# EAGLE design 8iPanelDec (EAGLE 6.6.0)
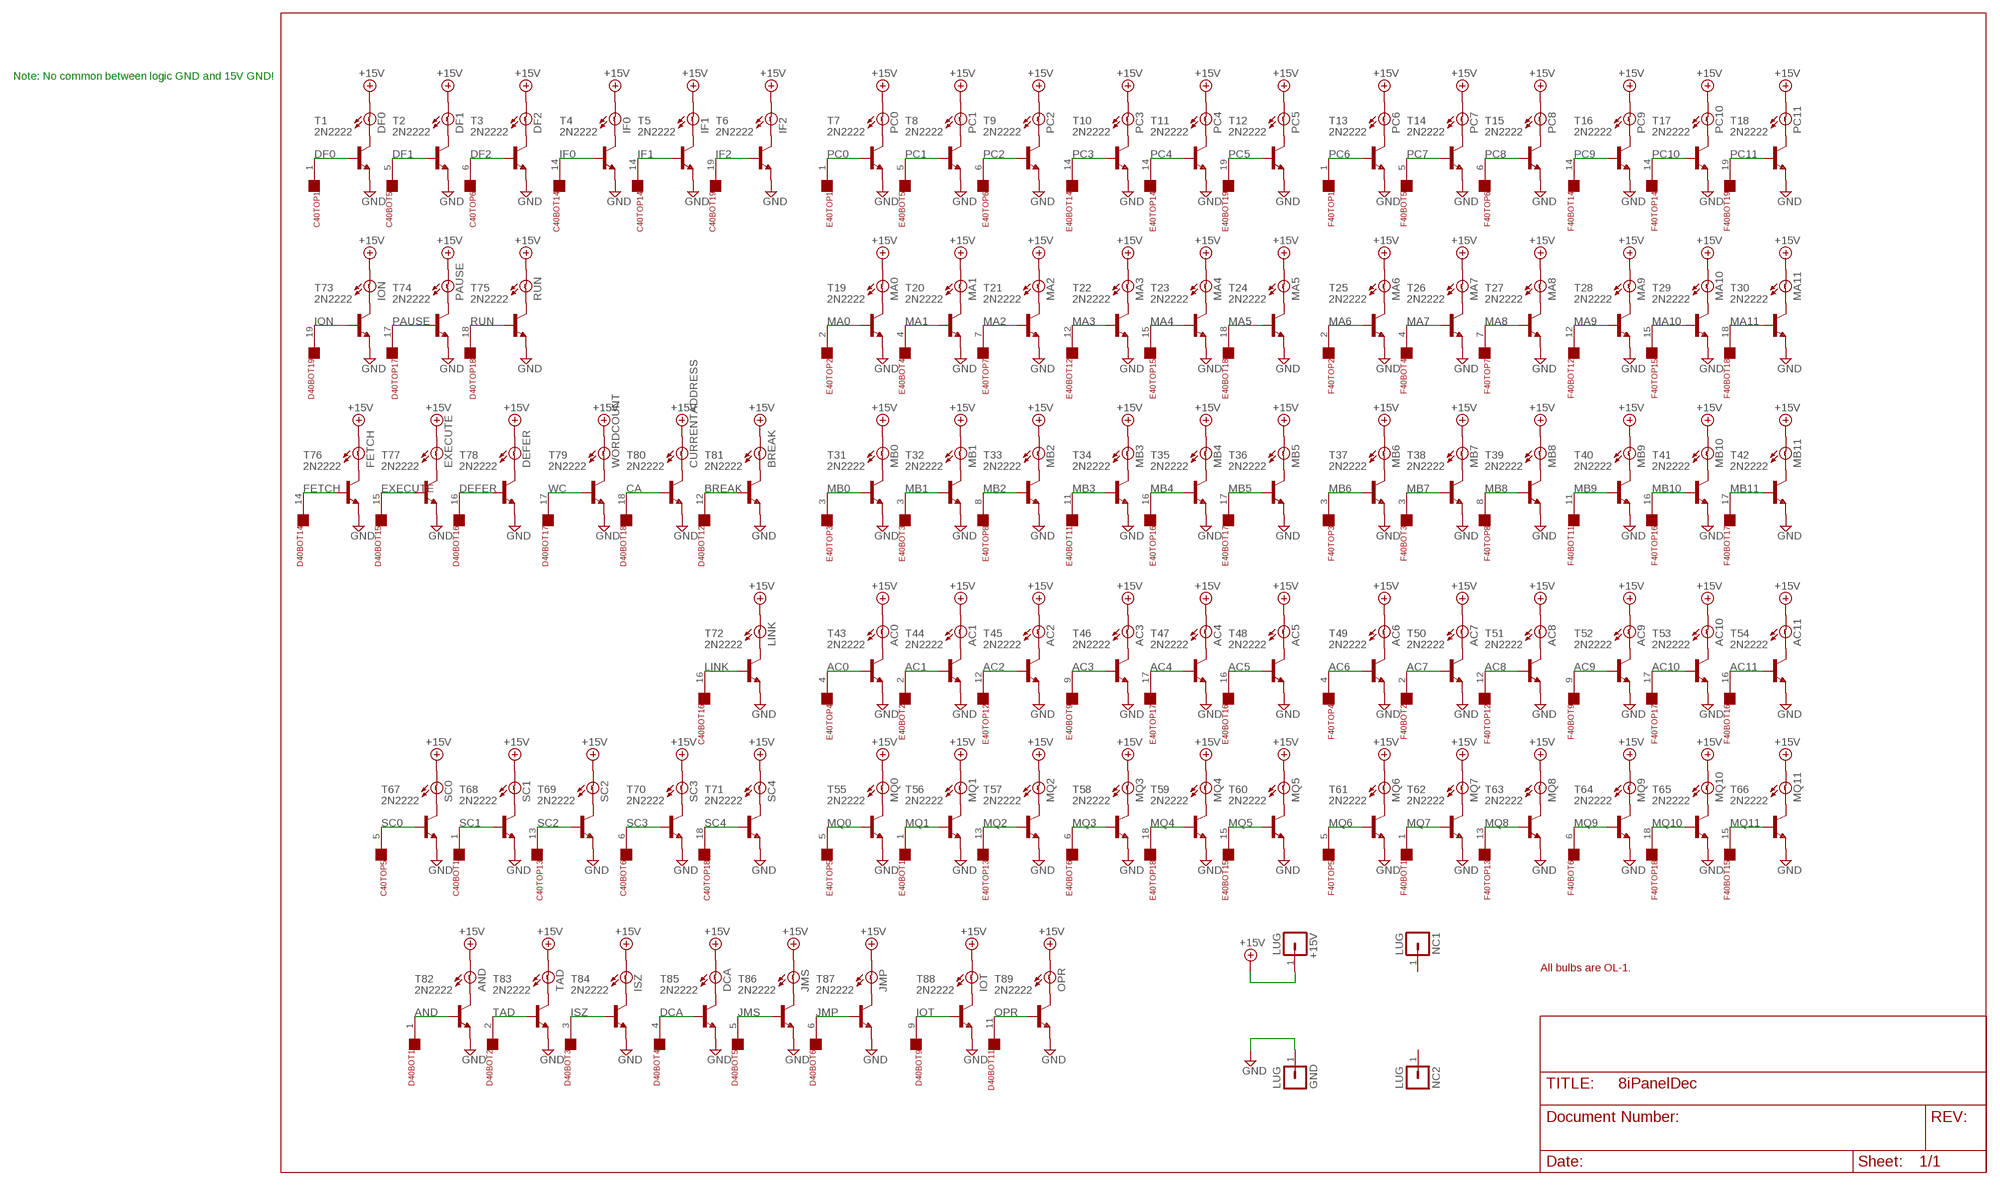
[diagram p0: schematic, sheet 1]

## Parts
+15V  LUG  [SPADELUG]
AC0  BULB  [BULB]
AC1  BULB  [BULB]
AC2  BULB  [BULB]
AC3  BULB  [BULB]
AC4  BULB  [BULB]
AC5  BULB  [BULB]
AC6  BULB  [BULB]
AC7  BULB  [BULB]
AC8  BULB  [BULB]
AC9  BULB  [BULB]
AC10  BULB  [BULB]
AC11  BULB  [BULB]
AND  BULB  [BULB]
BREAK  BULB  [BULB]
C40BOT  FLEX19  [FLEX19]
C40TOP  FLEX19  [FLEX19]
CURRENTADDRESS  BULB  [BULB]
D40BOT  FLEX19  [FLEX19]
D40TOP  FLEX19  [FLEX19]
DCA  BULB  [BULB]
DEFER  BULB  [BULB]
DF0  BULB  [BULB]
DF1  BULB  [BULB]
DF2  BULB  [BULB]
E40BOT  FLEX19  [FLEX19]
E40TOP  FLEX19  [FLEX19]
EXECUTE  BULB  [BULB]
F40BOT  FLEX19  [FLEX19]
F40TOP  FLEX19  [FLEX19]
FETCH  BULB  [BULB]
GND  LUG  [SPADELUG]
IF0  BULB  [BULB]
IF1  BULB  [BULB]
IF2  BULB  [BULB]
ION  BULB  [BULB]
IOT  BULB  [BULB]
ISZ  BULB  [BULB]
JMP  BULB  [BULB]
JMS  BULB  [BULB]
LINK  BULB  [BULB]
MA0  BULB  [BULB]
MA1  BULB  [BULB]
MA2  BULB  [BULB]
MA3  BULB  [BULB]
MA4  BULB  [BULB]
MA5  BULB  [BULB]
MA6  BULB  [BULB]
MA7  BULB  [BULB]
MA8  BULB  [BULB]
MA9  BULB  [BULB]
MA10  BULB  [BULB]
MA11  BULB  [BULB]
MB0  BULB  [BULB]
MB1  BULB  [BULB]
MB2  BULB  [BULB]
MB3  BULB  [BULB]
MB4  BULB  [BULB]
MB5  BULB  [BULB]
MB6  BULB  [BULB]
MB7  BULB  [BULB]
MB8  BULB  [BULB]
MB9  BULB  [BULB]
MB10  BULB  [BULB]
MB11  BULB  [BULB]
MQ0  BULB  [BULB]
MQ1  BULB  [BULB]
MQ2  BULB  [BULB]
MQ3  BULB  [BULB]
MQ4  BULB  [BULB]
MQ5  BULB  [BULB]
MQ6  BULB  [BULB]
MQ7  BULB  [BULB]
MQ8  BULB  [BULB]
MQ9  BULB  [BULB]
MQ10  BULB  [BULB]
MQ11  BULB  [BULB]
NC1  LUG  [SPADELUG]
NC2  LUG  [SPADELUG]
OPR  BULB  [BULB]
PAUSE  BULB  [BULB]
PC0  BULB  [BULB]
PC1  BULB  [BULB]
PC2  BULB  [BULB]
PC3  BULB  [BULB]
PC4  BULB  [BULB]
PC5  BULB  [BULB]
PC6  BULB  [BULB]
PC7  BULB  [BULB]
PC8  BULB  [BULB]
PC9  BULB  [BULB]
PC10  BULB  [BULB]
PC11  BULB  [BULB]
RUN  BULB  [BULB]
SC0  BULB  [BULB]
SC1  BULB  [BULB]
SC2  BULB  [BULB]
SC3  BULB  [BULB]
SC4  BULB  [BULB]
T1  2N2222  -NPN-TO92  [TO92]
T2  2N2222  -NPN-TO92  [TO92]
T3  2N2222  -NPN-TO92  [TO92]
T4  2N2222  -NPN-TO92  [TO92]
T5  2N2222  -NPN-TO92  [TO92]
T6  2N2222  -NPN-TO92  [TO92]
T7  2N2222  -NPN-TO92  [TO92]
T8  2N2222  -NPN-TO92  [TO92]
T9  2N2222  -NPN-TO92  [TO92]
T10  2N2222  -NPN-TO92  [TO92]
T11  2N2222  -NPN-TO92  [TO92]
T12  2N2222  -NPN-TO92  [TO92]
T13  2N2222  -NPN-TO92  [TO92]
T14  2N2222  -NPN-TO92  [TO92]
T15  2N2222  -NPN-TO92  [TO92]
T16  2N2222  -NPN-TO92  [TO92]
T17  2N2222  -NPN-TO92  [TO92]
T18  2N2222  -NPN-TO92  [TO92]
T19  2N2222  -NPN-TO92  [TO92]
T20  2N2222  -NPN-TO92  [TO92]
T21  2N2222  -NPN-TO92  [TO92]
T22  2N2222  -NPN-TO92  [TO92]
T23  2N2222  -NPN-TO92  [TO92]
T24  2N2222  -NPN-TO92  [TO92]
T25  2N2222  -NPN-TO92  [TO92]
T26  2N2222  -NPN-TO92  [TO92]
T27  2N2222  -NPN-TO92  [TO92]
T28  2N2222  -NPN-TO92  [TO92]
T29  2N2222  -NPN-TO92  [TO92]
T30  2N2222  -NPN-TO92  [TO92]
T31  2N2222  -NPN-TO92  [TO92]
T32  2N2222  -NPN-TO92  [TO92]
T33  2N2222  -NPN-TO92  [TO92]
T34  2N2222  -NPN-TO92  [TO92]
T35  2N2222  -NPN-TO92  [TO92]
T36  2N2222  -NPN-TO92  [TO92]
T37  2N2222  -NPN-TO92  [TO92]
T38  2N2222  -NPN-TO92  [TO92]
T39  2N2222  -NPN-TO92  [TO92]
T40  2N2222  -NPN-TO92  [TO92]
T41  2N2222  -NPN-TO92  [TO92]
T42  2N2222  -NPN-TO92  [TO92]
T43  2N2222  -NPN-TO92  [TO92]
T44  2N2222  -NPN-TO92  [TO92]
T45  2N2222  -NPN-TO92  [TO92]
T46  2N2222  -NPN-TO92  [TO92]
T47  2N2222  -NPN-TO92  [TO92]
T48  2N2222  -NPN-TO92  [TO92]
T49  2N2222  -NPN-TO92  [TO92]
T50  2N2222  -NPN-TO92  [TO92]
T51  2N2222  -NPN-TO92  [TO92]
T52  2N2222  -NPN-TO92  [TO92]
T53  2N2222  -NPN-TO92  [TO92]
T54  2N2222  -NPN-TO92  [TO92]
T55  2N2222  -NPN-TO92  [TO92]
T56  2N2222  -NPN-TO92  [TO92]
T57  2N2222  -NPN-TO92  [TO92]
T58  2N2222  -NPN-TO92  [TO92]
T59  2N2222  -NPN-TO92  [TO92]
T60  2N2222  -NPN-TO92  [TO92]
T61  2N2222  -NPN-TO92  [TO92]
T62  2N2222  -NPN-TO92  [TO92]
T63  2N2222  -NPN-TO92  [TO92]
T64  2N2222  -NPN-TO92  [TO92]
T65  2N2222  -NPN-TO92  [TO92]
T66  2N2222  -NPN-TO92  [TO92]
T67  2N2222  -NPN-TO92  [TO92]
T68  2N2222  -NPN-TO92  [TO92]
T69  2N2222  -NPN-TO92  [TO92]
T70  2N2222  -NPN-TO92  [TO92]
T71  2N2222  -NPN-TO92  [TO92]
T72  2N2222  -NPN-TO92  [TO92]
T73  2N2222  -NPN-TO92  [TO92]
T74  2N2222  -NPN-TO92  [TO92]
T75  2N2222  -NPN-TO92  [TO92]
T76  2N2222  -NPN-TO92  [TO92]
T77  2N2222  -NPN-TO92  [TO92]
T78  2N2222  -NPN-TO92  [TO92]
T79  2N2222  -NPN-TO92  [TO92]
T80  2N2222  -NPN-TO92  [TO92]
T81  2N2222  -NPN-TO92  [TO92]
T82  2N2222  -NPN-TO92  [TO92]
T83  2N2222  -NPN-TO92  [TO92]
T84  2N2222  -NPN-TO92  [TO92]
T85  2N2222  -NPN-TO92  [TO92]
T86  2N2222  -NPN-TO92  [TO92]
T87  2N2222  -NPN-TO92  [TO92]
T88  2N2222  -NPN-TO92  [TO92]
T89  2N2222  -NPN-TO92  [TO92]
TAD  BULB  [BULB]
WORDCOUNT  BULB  [BULB]

## Nets
+15V [supply]: +15V.1 AC0.A AC1.A AC2.A AC3.A AC4.A AC5.A AC6.A AC7.A AC8.A AC9.A AC10.A AC11.A AND.A BREAK.A CURRENTADDRESS.A DCA.A DEFER.A DF0.A DF1.A DF2.A EXECUTE.A FETCH.A IF0.A IF1.A IF2.A ION.A IOT.A ISZ.A JMP.A JMS.A LINK.A MA0.A MA1.A MA2.A MA3.A MA4.A MA5.A MA6.A MA7.A MA8.A MA9.A MA10.A MA11.A MB0.A MB1.A MB2.A MB3.A MB4.A MB5.A MB6.A MB7.A MB8.A MB9.A MB10.A MB11.A MQ0.A MQ1.A MQ2.A MQ3.A MQ4.A MQ5.A MQ6.A MQ7.A MQ8.A MQ9.A MQ10.A MQ11.A OPR.A PAUSE.A PC0.A PC1.A PC2.A PC3.A PC4.A PC5.A PC6.A PC7.A PC8.A PC9.A PC10.A PC11.A RUN.A SC0.A SC1.A SC2.A SC3.A SC4.A TAD.A WORDCOUNT.A
AC0: E40TOP.4 T43.2(B)
AC1: E40BOT.2 T44.2(B)
AC2: E40TOP.12 T45.2(B)
AC3: E40BOT.9 T46.2(B)
AC4: E40TOP.17 T47.2(B)
AC5: E40BOT.16 T48.2(B)
AC6: F40TOP.4 T49.2(B)
AC7: F40BOT.2 T50.2(B)
AC8: F40TOP.12 T51.2(B)
AC9: F40BOT.9 T52.2(B)
AC10: F40TOP.17 T53.2(B)
AC11: F40BOT.16 T54.2(B)
AND: D40BOT.1 T82.2(B)
BREAK: D40BOT.12 T81.2(B)
CA: D40BOT.18 T80.2(B)
DCA: D40BOT.4 T85.2(B)
DEFER: D40BOT.16 T78.2(B)
DF0: C40TOP.1 T1.2(B)
DF1: C40BOT.5 T2.2(B)
DF2: C40TOP.6 T3.2(B)
EXECUTE: D40BOT.15 T77.2(B)
FETCH: D40BOT.14 T76.2(B)
GND [supply]: GND.1 T1.1(E) T2.1(E) T3.1(E) T4.1(E) T5.1(E) T6.1(E) T7.1(E) T8.1(E) T9.1(E) T10.1(E) T11.1(E) T12.1(E) T13.1(E) T14.1(E) T15.1(E) T16.1(E) T17.1(E) T18.1(E) T19.1(E) T20.1(E) T21.1(E) T22.1(E) T23.1(E) T24.1(E) T25.1(E) T26.1(E) T27.1(E) T28.1(E) T29.1(E) T30.1(E) T31.1(E) T32.1(E) T33.1(E) T34.1(E) T35.1(E) T36.1(E) T37.1(E) T38.1(E) T39.1(E) T40.1(E) T41.1(E) T42.1(E) T43.1(E) T44.1(E) T45.1(E) T46.1(E) T47.1(E) T48.1(E) T49.1(E) T50.1(E) T51.1(E) T52.1(E) T53.1(E) T54.1(E) T55.1(E) T56.1(E) T57.1(E) T58.1(E) T59.1(E) T60.1(E) T61.1(E) T62.1(E) T63.1(E) T64.1(E) T65.1(E) T66.1(E) T67.1(E) T68.1(E) T69.1(E) T70.1(E) T71.1(E) T72.1(E) T73.1(E) T74.1(E) T75.1(E) T76.1(E) T77.1(E) T78.1(E) T79.1(E) T80.1(E) T81.1(E) T82.1(E) T83.1(E) T84.1(E) T85.1(E) T86.1(E) T87.1(E) T88.1(E) T89.1(E)
IF0: C40BOT.14 T4.2(B)
IF1: C40TOP.14 T5.2(B)
IF2: C40BOT.19 T6.2(B)
ION: D40BOT.19 T73.2(B)
IOT: D40BOT.9 T88.2(B)
ISZ: D40BOT.3 T84.2(B)
JMP: D40BOT.6 T87.2(B)
JMS: D40BOT.5 T86.2(B)
LINK: C40BOT.16 T72.2(B)
MA0: E40TOP.2 T19.2(B)
MA1: E40BOT.4 T20.2(B)
MA2: E40TOP.7 T21.2(B)
MA3: E40BOT.12 T22.2(B)
MA4: E40TOP.15 T23.2(B)
MA5: E40BOT.18 T24.2(B)
MA6: F40TOP.2 T25.2(B)
MA7: F40BOT.4 T26.2(B)
MA8: F40TOP.7 T27.2(B)
MA9: F40BOT.12 T28.2(B)
MA10: F40TOP.15 T29.2(B)
MA11: F40BOT.18 T30.2(B)
MB0: E40TOP.3 T31.2(B)
MB1: E40BOT.3 T32.2(B)
MB2: E40TOP.8 T33.2(B)
MB3: E40BOT.11 T34.2(B)
MB4: E40TOP.16 T35.2(B)
MB5: E40BOT.17 T36.2(B)
MB6: F40TOP.3 T37.2(B)
MB7: F40BOT.3 T38.2(B)
MB8: F40TOP.8 T39.2(B)
MB9: F40BOT.11 T40.2(B)
MB10: F40TOP.16 T41.2(B)
MB11: F40BOT.17 T42.2(B)
MQ0: E40TOP.5 T55.2(B)
MQ1: E40BOT.1 T56.2(B)
MQ2: E40TOP.13 T57.2(B)
MQ3: E40BOT.6 T58.2(B)
MQ4: E40TOP.18 T59.2(B)
MQ5: E40BOT.15 T60.2(B)
MQ6: F40TOP.5 T61.2(B)
MQ7: F40BOT.1 T62.2(B)
MQ8: F40TOP.13 T63.2(B)
MQ9: F40BOT.6 T64.2(B)
MQ10: F40TOP.18 T65.2(B)
MQ11: F40BOT.15 T66.2(B)
N$1: DF0.B T1.3(C)
N$2: DF1.B T2.3(C)
N$3: DF2.B T3.3(C)
N$4: IF0.B T4.3(C)
N$5: IF1.B T5.3(C)
N$6: IF2.B T6.3(C)
N$7: PC0.B T7.3(C)
N$8: PC1.B T8.3(C)
N$9: PC2.B T9.3(C)
N$10: PC3.B T10.3(C)
N$11: PC4.B T11.3(C)
N$12: PC5.B T12.3(C)
N$13: PC6.B T13.3(C)
N$14: PC7.B T14.3(C)
N$15: PC8.B T15.3(C)
N$16: PC9.B T16.3(C)
N$17: PC10.B T17.3(C)
N$18: PC11.B T18.3(C)
N$19: MA0.B T19.3(C)
N$20: MA1.B T20.3(C)
N$21: MA2.B T21.3(C)
N$22: MA3.B T22.3(C)
N$23: MA4.B T23.3(C)
N$24: MA5.B T24.3(C)
N$25: MA6.B T25.3(C)
N$26: MA7.B T26.3(C)
N$27: MA8.B T27.3(C)
N$28: MA9.B T28.3(C)
N$29: MA10.B T29.3(C)
N$30: MA11.B T30.3(C)
N$31: MB0.B T31.3(C)
N$32: MB1.B T32.3(C)
N$33: MB2.B T33.3(C)
N$34: MB3.B T34.3(C)
N$35: MB4.B T35.3(C)
N$36: MB5.B T36.3(C)
N$37: MB6.B T37.3(C)
N$38: MB7.B T38.3(C)
N$39: MB8.B T39.3(C)
N$40: MB9.B T40.3(C)
N$41: MB10.B T41.3(C)
N$42: MB11.B T42.3(C)
N$43: AC0.B T43.3(C)
N$44: AC1.B T44.3(C)
N$45: AC2.B T45.3(C)
N$46: AC3.B T46.3(C)
N$47: AC4.B T47.3(C)
N$48: AC5.B T48.3(C)
N$49: AC6.B T49.3(C)
N$50: AC7.B T50.3(C)
N$51: AC8.B T51.3(C)
N$52: AC9.B T52.3(C)
N$53: AC10.B T53.3(C)
N$54: AC11.B T54.3(C)
N$55: MQ0.B T55.3(C)
N$56: MQ1.B T56.3(C)
N$57: MQ2.B T57.3(C)
N$58: MQ3.B T58.3(C)
N$59: MQ4.B T59.3(C)
N$60: MQ5.B T60.3(C)
N$61: MQ6.B T61.3(C)
N$62: MQ7.B T62.3(C)
N$63: MQ8.B T63.3(C)
N$64: MQ9.B T64.3(C)
N$65: MQ10.B T65.3(C)
N$66: MQ11.B T66.3(C)
N$67: SC0.B T67.3(C)
N$68: SC1.B T68.3(C)
N$69: SC2.B T69.3(C)
N$70: SC3.B T70.3(C)
N$71: SC4.B T71.3(C)
N$72: LINK.B T72.3(C)
N$73: ION.B T73.3(C)
N$74: PAUSE.B T74.3(C)
N$75: RUN.B T75.3(C)
N$76: FETCH.B T76.3(C)
N$77: EXECUTE.B T77.3(C)
N$78: DEFER.B T78.3(C)
N$79: T79.3(C) WORDCOUNT.B
N$80: CURRENTADDRESS.B T80.3(C)
N$81: BREAK.B T81.3(C)
N$82: AND.B T82.3(C)
N$83: T83.3(C) TAD.B
N$84: ISZ.B T84.3(C)
N$85: DCA.B T85.3(C)
N$86: JMS.B T86.3(C)
N$87: JMP.B T87.3(C)
N$88: IOT.B T88.3(C)
N$89: OPR.B T89.3(C)
OPR: D40BOT.11 T89.2(B)
PAUSE: D40TOP.17 T74.2(B)
PC0: E40TOP.1 T7.2(B)
PC1: E40BOT.5 T8.2(B)
PC2: E40TOP.6 T9.2(B)
PC3: E40BOT.14 T10.2(B)
PC4: E40TOP.14 T11.2(B)
PC5: E40BOT.19 T12.2(B)
PC6: F40TOP.1 T13.2(B)
PC7: F40BOT.5 T14.2(B)
PC8: F40TOP.6 T15.2(B)
PC9: F40BOT.14 T16.2(B)
PC10: F40TOP.14 T17.2(B)
PC11: F40BOT.19 T18.2(B)
RUN: D40TOP.18 T75.2(B)
SC0: C40TOP.5 T67.2(B)
SC1: C40BOT.1 T68.2(B)
SC2: C40TOP.13 T69.2(B)
SC3: C40BOT.6 T70.2(B)
SC4: C40TOP.18 T71.2(B)
TAD: D40BOT.2 T83.2(B)
WC: D40BOT.17 T79.2(B)
Unconnected: C40BOT.2 C40BOT.3 C40BOT.4 C40BOT.7 C40BOT.8 C40BOT.9 C40BOT.10 C40BOT.11 C40BOT.12 C40BOT.13 C40BOT.15 C40BOT.17 C40BOT.18 C40TOP.2 C40TOP.3 C40TOP.4 C40TOP.7 C40TOP.8 C40TOP.9 C40TOP.10 C40TOP.11 C40TOP.12 C40TOP.15 C40TOP.16 C40TOP.17 C40TOP.19 D40BOT.7 D40BOT.8 D40BOT.10 D40BOT.13 D40TOP.1 D40TOP.2 D40TOP.3 D40TOP.4 D40TOP.5 D40TOP.6 D40TOP.7 D40TOP.8 D40TOP.9 D40TOP.10 D40TOP.11 D40TOP.12 D40TOP.13 D40TOP.14 D40TOP.15 D40TOP.16 D40TOP.19 E40BOT.7 E40BOT.8 E40BOT.10 E40BOT.13 E40TOP.9 E40TOP.10 E40TOP.11 E40TOP.19 F40BOT.7 F40BOT.8 F40BOT.10 F40BOT.13 F40TOP.9 F40TOP.10 F40TOP.11 F40TOP.19 NC1.1 NC2.1

## Notes on the sheet
- Note: No common between logic GND and 15V GND!
- All bulbs are OL-1.

## Library data of the parts
+15V GND NC1 NC2 = dec-con:LUG: Spade Lug
AC0 AC1-AC11 AND BREAK CURRENTADDRESS DCA DEFER DF0 DF1 DF2 EXECUTE FETCH IF0 IF1 IF2 ION IOT ISZ JMP JMS LINK MA0 MA1-MA11 MB0 MB1-MB11 MQ0 MQ1-MQ11 OPR PAUSE PC0 PC1-PC11 RUN SC0 SC1-SC4 TAD WORDCOUNT = dec-con:BULB: T 1 3/4 Bulb
C40BOT C40TOP D40BOT D40TOP E40BOT E40TOP F40BOT F40TOP = dec-con:FLEX19: 19 pin Flexprint Connection
T1-T89 = transistor:*-NPN-: NPN Transistror BF959 corrected 2008.03.06

## Net classes
1 supply: width 0.762 mm

## Board
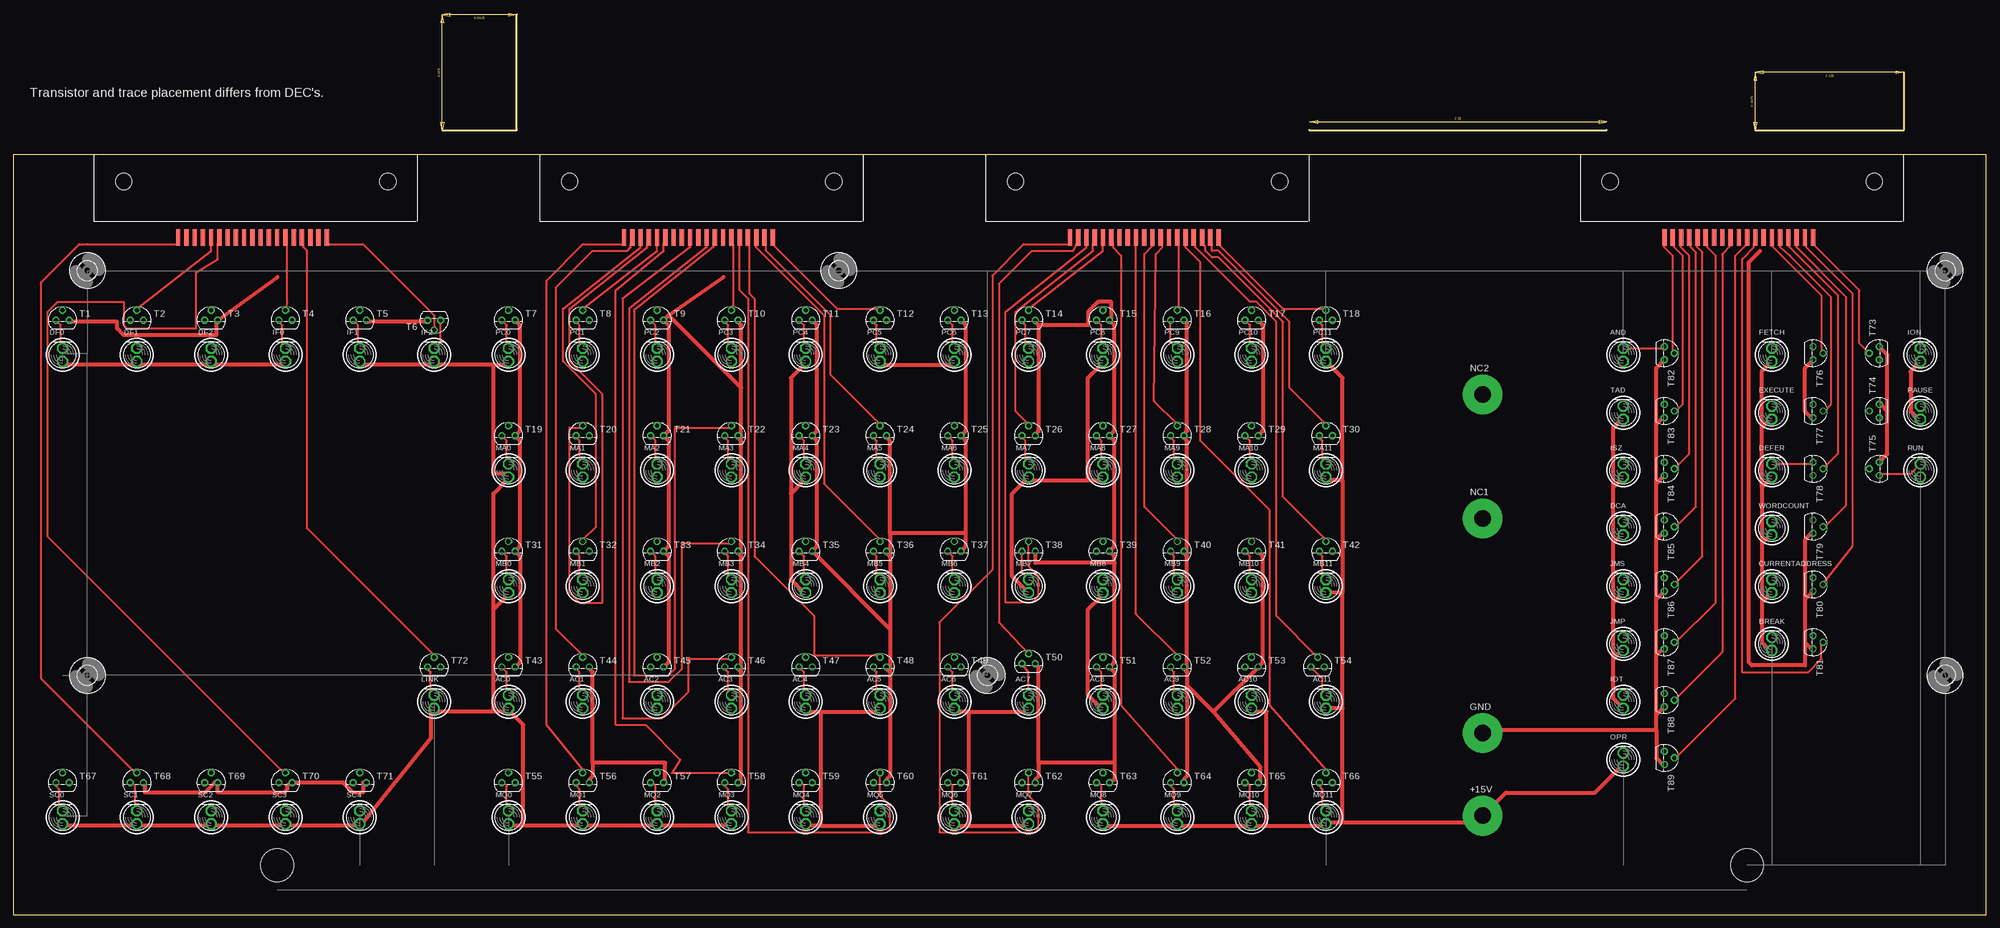
[diagram p1: board, top side]
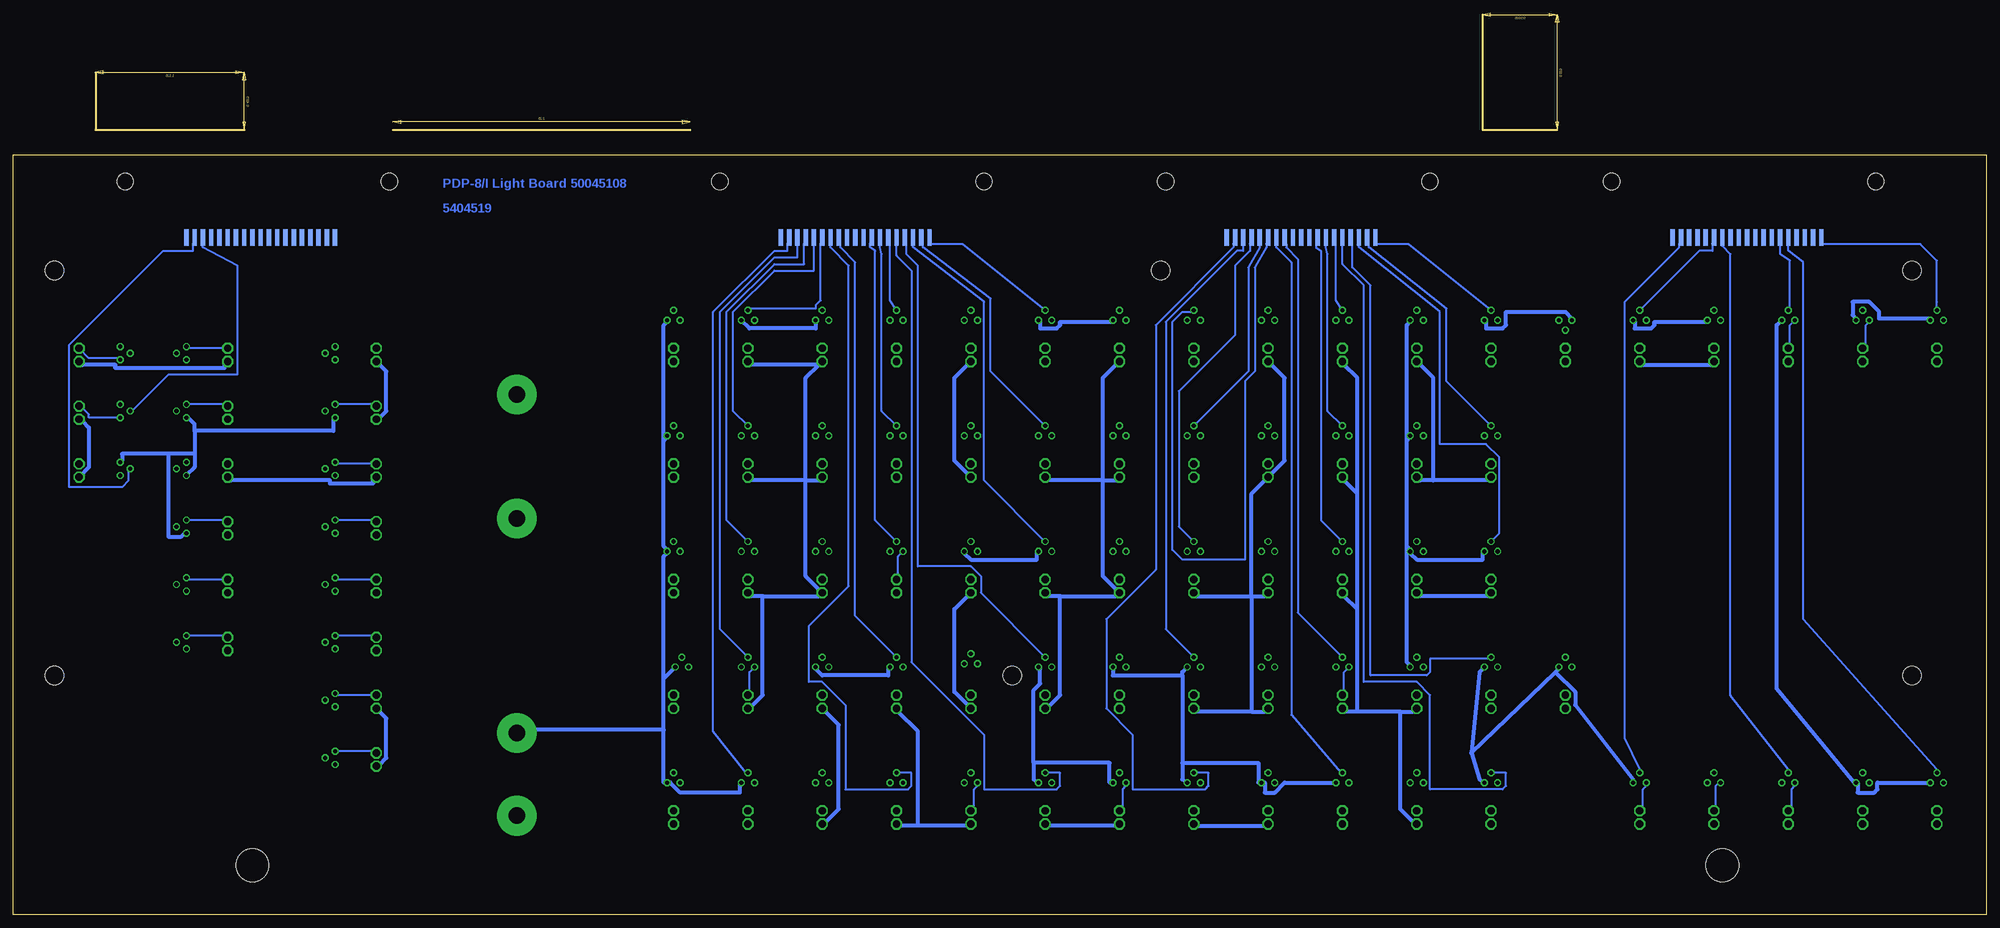
[diagram p2: board, bottom side, seen from below]

Size 379.41 x 173.04 mm. Coordinates in mm from the lower left corner, seen from the top.
Outline: 82.55,150.81 96.84,150.81 96.84,173.04
Outline: 334.96,150.81 363.54,150.81 363.54,161.93
Outline: 249.24,150.81 306.39,150.81
Outline: 0,0 6.35,0 379.41,0 379.41,146.05 371.48,146.05 14.29,146.05 0,146.05 0,141.29 0,123.83 0,46.04 0,14.29 0,0
Copper layers (1+16): Top 0.035mm / dielectric 1.5mm / Bottom 0.035mm
Design rules "15mils *": minimum track width 15mil, minimum drill 24mil, track to track 15mil, track to pad 10mil, pad to pad 10mil, via to via 10mil, smd to smd 10mil, copper to edge 25mil, drill to drill 10mil, minimum pad ring 10mil, minimum via ring 8mil, stop-mask expansion 0mil, vias tented up to drill 0mil, thermal gap 10mil
Holes 6.35 mm at 50.8,9.53 333.38,9.53

### Footprints (pad centres in the part's own frame; a part is rotated, then mirrored left to right if it is on the bottom)
SPADELUG = drill 3.175 pad 7.62: 1 0,0
BULB = drill 1.422 octagon: A 0,0; B 0,2.54
FLEX19 = smd 3.175 x 0.838: 1 0,14.287; 2 0,12.7; 3 0,11.113; 4 0,9.525; 5 0,7.938; 6 0,6.35; 7 0,4.763; 8 0,3.175; 9 0,1.587; 10 0,0; 11 0,-1.587; 12 0,-3.175; 13 0,-4.763; 14 0,-6.35; 15 0,-7.938; 16 0,-9.525; 17 0,-11.113; 18 0,-12.7; 19 0,-14.287
TO92 = drill 0.813 octagon: 1 1.27,0; 2 0,1.905; 3 -1.27,0
STRAIN-RELIEF = hole 3.175: 7.62,56.515; 7.62,5.715
3,6 = hole 3.6: 0,0

### Placement (x,y rotation side)
+15V  282.57,19.05 0 top
AC0  95.25,39.69 0 top
AC1  109.54,39.69 0 top
AC2  123.83,39.69 0 top
AC3  138.11,39.69 0 top
AC4  152.4,39.69 0 top
AC5  166.69,39.69 0 top
AC6  180.97,39.69 0 top
AC7  195.26,39.69 0 top
AC8  209.55,39.69 0 top
AC9  223.84,39.69 0 top
AC10  238.12,39.69 0 top
AC11  252.41,39.69 0 top
AND  309.56,106.36 0 top
BREAK  338.14,50.8 0 top
C40BOT  46.04,130.18 90 top
C40TOP  46.04,130.18 270 bottom
CURRENTADDRESS  338.14,61.91 0 top
D40BOT  331.79,130.18 90 top
D40TOP  331.79,130.18 270 bottom
DCA  309.56,73.03 0 top
DEFER  338.14,84.14 0 top
DF0  9.53,106.36 0 top
DF1  23.81,106.36 0 top
DF2  38.1,106.36 0 top
E40BOT  131.76,130.18 90 top
E40TOP  131.76,130.18 270 bottom
EXECUTE  338.14,95.25 0 top
F40BOT  217.49,130.18 90 top
F40TOP  217.49,130.18 270 bottom
FETCH  338.14,106.36 0 top
GND  282.57,34.92 0 top
IF0  52.39,106.36 0 top
IF1  66.67,106.36 0 top
IF2  80.96,106.36 0 top
ION  366.71,106.36 0 top
IOT  309.56,39.69 0 top
ISZ  309.56,84.14 0 top
JMP  309.56,50.8 0 top
JMS  309.56,61.91 0 top
LINK  80.96,39.69 0 top
MA0  95.25,84.14 0 top
MA1  109.54,84.14 0 top
MA2  123.83,84.14 0 top
MA3  138.11,84.14 0 top
MA4  152.4,84.14 0 top
MA5  166.69,84.14 0 top
MA6  180.97,84.14 0 top
MA7  195.26,84.14 0 top
MA8  209.55,84.14 0 top
MA9  223.84,84.14 0 top
MA10  238.12,84.14 0 top
MA11  252.41,84.14 0 top
MB0  95.25,61.91 0 top
MB1  109.54,61.91 0 top
MB2  123.83,61.91 0 top
MB3  138.11,61.91 0 top
MB4  152.4,61.91 0 top
MB5  166.69,61.91 0 top
MB6  180.97,61.91 0 top
MB7  195.26,61.91 0 top
MB8  209.55,61.91 0 top
MB9  223.84,61.91 0 top
MB10  238.12,61.91 0 top
MB11  252.41,61.91 0 top
MQ0  95.25,17.46 0 top
MQ1  109.54,17.46 0 top
MQ2  123.83,17.46 0 top
MQ3  138.11,17.46 0 top
MQ4  152.4,17.46 0 top
MQ5  166.69,17.46 0 top
MQ6  180.97,17.46 0 top
MQ7  195.26,17.46 0 top
MQ8  209.55,17.46 0 top
MQ9  223.84,17.46 0 top
MQ10  238.12,17.46 0 top
MQ11  252.41,17.46 0 top
NC1  282.57,76.2 0 top
NC2  282.57,100.01 0 top
OPR  309.56,28.57 0 top
PAUSE  366.71,95.25 0 top
PC0  95.25,106.36 0 top
PC1  109.54,106.36 0 top
PC2  123.83,106.36 0 top
PC3  138.11,106.36 0 top
PC4  152.4,106.36 0 top
PC5  166.69,106.36 0 top
PC6  180.97,106.36 0 top
PC7  195.26,106.36 0 top
PC8  209.55,106.36 0 top
PC9  223.84,106.36 0 top
PC10  238.12,106.36 0 top
PC11  252.41,106.36 0 top
RUN  366.71,84.14 0 top
SC0  9.53,17.46 0 top
SC1  23.81,17.46 0 top
SC2  38.1,17.46 0 top
SC3  52.39,17.46 0 top
SC4  66.67,17.46 0 top
T1  9.53,114.3 0 top
T2  23.81,114.3 0 top
T3  38.1,114.3 0 top
T4  52.39,114.3 0 top
T5  66.67,114.3 0 top
T6  80.96,114.3 180 top
T7  95.25,114.3 0 top
T8  109.54,114.3 0 top
T9  123.83,114.3 0 top
T10  138.11,114.3 0 top
T11  152.4,114.3 0 top
T12  166.69,114.3 0 top
T13  180.97,114.3 0 top
T14  195.26,114.3 0 top
T15  209.55,114.3 0 top
T16  223.84,114.3 0 top
T17  238.12,114.3 0 top
T18  252.41,114.3 0 top
T19  95.25,92.08 0 top
T20  109.54,92.08 0 top
T21  123.83,92.08 0 top
T22  138.11,92.08 0 top
T23  152.4,92.08 0 top
T24  166.69,92.08 0 top
T25  180.97,92.08 0 top
T26  195.26,92.08 0 top
T27  209.55,92.08 0 top
T28  223.84,92.08 0 top
T29  238.12,92.08 0 top
T30  252.41,92.08 0 top
T31  95.25,69.85 0 top
T32  109.54,69.85 0 top
T33  123.83,69.85 0 top
T34  138.11,69.85 0 top
T35  152.4,69.85 0 top
T36  166.69,69.85 0 top
T37  180.97,69.85 0 top
T38  195.26,69.85 0 top
T39  209.55,69.85 0 top
T40  223.84,69.85 0 top
T41  238.12,69.85 0 top
T42  252.41,69.85 0 top
T43  95.25,47.62 0 top
T44  109.54,47.62 0 top
T45  123.83,47.62 0 top
T46  138.11,47.62 0 top
T47  152.4,47.62 0 top
T48  166.69,47.62 0 top
T49  180.97,47.62 0 top
T50  195.26,48.26 0 top
T51  209.55,47.62 0 top
T52  223.84,47.62 0 top
T53  238.12,47.62 0 top
T54  250.82,47.62 0 top
T55  95.25,25.4 0 top
T56  109.54,25.4 0 top
T57  123.83,25.4 0 top
T58  138.11,25.4 0 top
T59  152.4,25.4 0 top
T60  166.69,25.4 0 top
T61  180.97,25.4 0 top
T62  195.26,25.4 0 top
T63  209.55,25.4 0 top
T64  223.84,25.4 0 top
T65  238.12,25.4 0 top
T66  252.41,25.4 0 top
T67  9.53,25.4 0 top
T68  23.81,25.4 0 top
T69  38.1,25.4 0 top
T70  52.39,25.4 0 top
T71  66.67,25.4 0 top
T72  80.96,47.62 0 top
T73  358.77,107.95 90 top
T74  358.77,96.84 90 top
T75  358.77,85.72 90 top
T76  346.07,107.95 270 top
T77  346.07,96.84 270 top
T78  346.07,85.72 270 top
T79  346.07,74.61 270 top
T80  346.07,63.5 270 top
T81  346.07,52.39 270 top
T82  317.5,107.95 270 top
T83  317.5,96.84 270 top
T84  317.5,85.72 270 top
T85  317.5,74.61 270 top
T86  317.5,63.5 270 top
T87  317.5,52.39 270 top
T88  317.5,41.27 270 top
T89  317.5,30.16 270 top
TAD  309.56,95.25 0 top
U$1  [STRAIN-RELIEF]  77.79,133.35 90 top
U$2  [STRAIN-RELIEF]  163.51,133.35 90 top
U$3  [STRAIN-RELIEF]  249.24,133.35 90 top
U$4  [STRAIN-RELIEF]  363.54,133.35 90 top
U$5  [3,6]  371.48,123.83 0 top
U$6  [3,6]  371.48,46.04 0 top
U$7  [3,6]  187.32,46.04 0 top
U$8  [3,6]  14.29,46.04 0 top
U$9  [3,6]  14.29,123.83 0 top
U$11  [3,6]  158.75,123.83 0 top
WORDCOUNT  338.14,73.03 0 top

### Tracks (layer width: path | path; a pad name or v marks a point on that pad's centre or on a via)
+15V
  Top 0.762: ION.A 364.81,104.46 364.81,96.84 366.08,95.57 PAUSE.A | 336.23,60.01 336.23,52.39 337.5,51.12 BREAK.A | 336.23,60.01 CURRENTADDRESS.A | 336.23,71.44 337.5,72.71 WORDCOUNT.A | 336.23,71.44 336.23,60.01 | 336.23,82.23 336.23,71.44 | DEFER.A 336.23,82.23 | 336.23,93.66 337.5,94.93 EXECUTE.A | 336.23,82.23 336.23,93.66 | 336.23,93.66 336.23,104.46 FETCH.A | 307.66,49.21 308.93,50.48 JMP.A | 307.66,49.21 307.66,41.59 IOT.A | 307.66,49.21 307.66,60.01 | 307.66,60.01 JMS.A | 307.66,71.44 308.93,72.71 DCA.A | 307.66,60.01 307.66,71.44 | 307.66,71.44 307.66,82.23 | 307.66,82.23 ISZ.A | 307.66,82.23 307.66,93.66 308.93,94.93 TAD.A | OPR.A 308.93,28.26 304.17,23.5 287.02,23.5 +15V.1 281.31,17.78 255.59,17.78 | 255.59,83.5 253.05,83.5 MA11.A | DF0.A 9.84,105.73 23.18,105.73 DF1.A 24.45,105.73 37.78,105.73 DF2.A 38.42,105.73 51.75,105.73 IF0.A | IF1.A 66.99,105.73 80.33,105.73 IF2.A 81.6,105.73 92.39,105.73 | 92.39,105.73 94.93,105.73 PC0.A | 92.39,105.73 92.39,84.77 94.93,84.77 MA0.A 94.93,83.5 92.39,80.96 92.39,58.74 | PC5.A 167.32,105.73 180.66,105.73 PC6.A | 206.69,83.5 209.23,83.5 MA8.A | 206.69,83.5 195.9,83.5 MA7.A 192.09,80.96 192.09,65.09 MB7.A | 206.69,83.5 206.69,103.19 209.23,105.73 PC8.A | 183.83,39.05 194.63,39.05 AC7.A | 183.83,39.05 181.29,39.05 AC6.A | 149.54,80.96 152.08,83.5 MA4.A | 149.54,80.96 149.54,64.45 152.08,61.91 MB4.A | 149.54,80.96 149.54,103.19 152.08,105.73 PC4.A | SC0.A 10.16,17.14 23.5,17.14 SC1.A 24.13,17.14 37.47,17.14 SC2.A 38.73,17.14 52.07,17.14 SC3.A 52.7,17.14 66.04,17.14 SC4.A 67.31,17.78 80.33,33.97 80.33,39.05 LINK.A 81.6,39.05 92.39,39.05 | AC10.A 238.44,39.05 240.98,39.05 240.98,17.14
  Top 0.762: 255.59,39.69 255.59,61.91 | 155.26,39.05 152.72,39.05 AC4.A | 155.26,39.05 166.05,39.05 AC5.A | 92.39,39.05 94.93,39.05 AC0.A 95.57,39.05 98.11,36.51 98.11,17.14 | 98.11,17.14 108.9,17.14 MQ1.A 110.17,17.14 123.51,17.14 MQ2.A 124.14,17.14 137.48,17.14 MQ3.A | 98.11,17.14 95.57,17.14 MQ0.A | 155.26,17.14 152.72,17.14 MQ4.A | 155.26,17.14 166.05,17.14 MQ5.A | 183.83,17.14 181.29,17.14 MQ6.A | 183.83,17.14 194.63,17.14 MQ7.A | MB8.A 209.23,61.28 206.69,58.74 206.69,42.23 209.23,39.69 AC8.A | MQ8.A 209.87,17.14 223.2,17.14 MQ9.A 224.47,17.14 237.81,17.14 MQ10.A 238.44,17.14 240.98,17.14 | 240.98,17.14 251.78,17.14 MQ11.A 253.05,17.78 255.59,17.78 | 92.39,58.74 94.93,61.28 MB0.A | 92.39,39.05 92.39,58.74 | 155.26,39.05 155.26,17.14 | 183.83,17.14 183.83,39.05 | 255.59,83.5 255.59,103.19 PC11.A | 255.59,17.78 255.59,39.69 | 255.59,39.69 AC11.A | 255.59,83.5 255.59,61.91 | 255.59,61.91 MB11.A
  Bottom 0.762: RUN.A 364.81,86.04 364.81,93.66 366.08,94.93 PAUSE.A | ION.A 366.08,105.73 359.73,105.73 359.73,105.09 338.77,105.09 338.77,105.73 FETCH.A | 235.27,61.28 224.47,61.28 MB9.A 227.01,65.09 227.01,83.5 | 235.27,61.28 237.81,61.28 MB10.A | 227.01,83.5 237.81,83.5 MA10.A | 227.01,83.5 224.47,83.5 MA9.A | 227.01,83.5 227.01,103.19 224.47,105.73 | OPR.A 308.93,28.89 307.66,30.16 307.66,37.78 IOT.A | AND.A 307.66,104.46 307.66,96.84 308.93,95.57 TAD.A | DEFER.A 337.5,83.5 318.45,83.5 318.45,82.87 310.2,82.87 310.2,83.5 ISZ.A | 106.36,83.5 108.9,83.5 MA1.A | 106.36,83.5 95.57,83.5 MA0.A | 106.36,83.5 106.36,103.19 PC1.A | IF1.A 66.36,105.73 53.02,105.73 IF0.A | 178.12,61.28 180.66,61.28 MB6.A | 178.12,61.28 167.32,61.28 MB5.A 169.86,65.09 169.86,83.5 | 169.86,83.5 180.66,83.5 MA6.A | 169.86,83.5 167.32,83.5 MA5.A | 169.86,83.5 169.86,103.19 PC5.A | PC7.A 198.44,103.19 198.44,87.31 MA7.A | MB7.A 198.44,58.74 198.44,42.86 AC7.A | 178.12,61.28 178.12,42.23 180.66,39.69 AC6.A | 120.97,39.05 123.51,39.05 AC2.A | 112.71,39.05 120.97,39.05 | 112.71,39.05 110.17,39.05 AC1.A | 120.97,58.74 123.51,61.28 MB2.A | 120.97,39.05 120.97,58.74 | 120.97,80.96 123.51,83.5 MA2.A | 120.97,58.74 120.97,80.96 | 120.97,80.96 120.97,103.19 123.51,105.73 PC2.A | 141.29,61.28 152.08,61.28 MB4.A | 141.29,61.28 138.75,61.28 MB3.A | 141.29,61.28 141.29,80.96 MA3.A 134.94,87.31 134.94,103.19 PC3.A | 141.29,39.05 152.08,39.05 AC4.A | 141.29,39.05 138.75,39.05 AC3.A | MB0.A 95.57,61.28 108.9,61.28 MB1.A | MQ4.A 152.08,17.14 138.75,17.14 MQ3.A | MQ6.A 180.66,17.14 167.32,17.14 MQ5.A | 205.42,17.14 195.9,17.14 MQ7.A | 205.42,17.14 209.23,17.14 MQ8.A
  Bottom 0.762: 205.42,17.14 205.42,35.24 209.23,39.05 AC8.A | AC9.A 220.66,36.51 220.66,20.32 223.2,17.78 MQ9.A | 141.29,61.28 141.29,39.05 | 112.71,39.05 112.71,20.32 110.17,17.78 MQ1.A | 235.27,61.28 235.27,42.23 237.81,39.69 AC10.A | 224.47,105.73 237.81,105.73 PC10.A | 224.47,105.73 PC9.A
AC0
  Bottom 0.381: T43.2 95.57,49.21 107,49.21 107,46.67 107.63,46.04 118.43,46.04 118.43,120.97 121.92,124.46 121.92,128.91 E40TOP.4
AC1
  Top 0.381: T44.2 109.54,49.85 104.46,54.93 104.46,120.65 111.44,127.64 118.11,127.64 118.75,128.27 118.75,128.91 E40BOT.2
AC2
  Bottom 0.381: T45.2 132.4,58.1 132.4,126.05 134.62,128.27 134.62,128.91 E40TOP.12
AC3
  Top 0.381: T46.2 138.11,49.21 129.86,49.21 129.86,42.86 124.78,37.78 117.16,37.78 117.16,118.43 130.18,128.27 E40BOT.9
AC4
  Bottom 0.381: T47.2 157.8,54.93 157.8,113.98 144.15,127.64 142.88,127.64 E40TOP.17
AC5
  Top 0.381: T48.2 166.69,49.85 153.99,49.85 153.99,57.47 142.56,68.9 142.56,118.43 141.6,119.38 141.6,128.91 E40BOT.16
AC6
  Bottom 0.381: T49.2 193.36,61.91 193.36,65.09 195.26,66.99 205.42,66.99 205.42,124.78 207.65,127 207.65,128.91 F40TOP.4
AC7
  Top 0.381: T50.2 189.55,56.2 189.55,121.28 195.9,127.64 203.84,127.64 204.47,128.91 F40BOT.2
AC8
  Bottom 0.381: T51.2 217.49,57.47 217.49,125.41 220.34,128.27 220.34,128.91 F40TOP.12
AC9
  Top 0.381: T52.2 223.84,49.85 215.9,57.78 F40BOT.9
AC10
  Bottom 0.381: T53.2 243.52,54.93 243.52,115.89 233.04,126.36 228.6,126.36 F40TOP.17
AC11
  Top 0.381: T54.2 242.89,57.47 242.89,113.98 239.08,117.79 237.81,117.79 227.33,128.27 227.33,128.91 F40BOT.16
AND
  Top 0.381: T82.2 319.09,108.27 319.09,126.68 317.5,128.27 D40BOT.1
BREAK
  Top 0.381: T81.2 347.66,52.39 347.66,49.21 345.12,46.67 332.42,46.67 332.42,126.05 334.64,128.27 334.64,128.91 D40BOT.12
CA
  Top 0.381: T80.2 353.69,70.8 353.69,119.38 344.81,128.27 344.81,128.91 D40BOT.18
DCA
  Top 0.381: T85.2 319.72,74.61 323.53,78.42 323.53,127.32 322.58,128.27 322.58,128.91 D40BOT.4
DEFER
  Top 0.406: D40BOT.16 341.31,128.59 350.84,119.06 350.84,88.58 T78.2
DF0
  Bottom 0.381: T1.2 9.53,117.79 9.53,125.73 12.7,128.91 31.75,128.91 C40TOP.1
DF1
  Top 0.381: T2.2 23.81,116.52 38.1,127.64 C40BOT.5
DF2
  Bottom 0.381: T3.2 37.78,116.52 37.78,125.73 39.69,127 C40TOP.6
EXECUTE
  Top 0.381: T77.2 348.3,96.84 349.57,98.11 349.57,118.75 341.63,126.68 339.73,128.27 D40BOT.15
FETCH
  Top 0.406: D40BOT.14 338.14,128.59 347.66,119.06 347.66,108.27 T76.2
GND
  Top 0.762: 344.49,52.39 345.76,51.12 T81.1 | 344.49,60.64 344.49,52.39 | 344.49,60.64 T80.1 | 344.49,60.64 344.49,72.07 345.76,73.34 T79.1 | 335.92,127.64 333.69,125.41 333.69,48.58 334.33,47.94 344.49,47.94 344.49,52.39 | T76.1 344.49,105.09 344.49,96.84 345.76,95.57 T77.1 | 360.36,96.84 360.36,88.58 T75.1 | 360.36,96.84 359.09,98.11 T74.1 | 360.36,96.84 360.36,107.63 T73.1 | 315.91,35.56 315.91,30.16 317.18,28.89 T89.1 | 315.91,35.56 315.91,38.42 | 315.91,38.42 T88.1 | 315.91,49.85 317.18,51.12 T87.1 | 315.91,38.42 315.91,49.85 | 315.91,49.85 315.91,60.64 | 315.91,60.64 T86.1 | 315.91,72.07 317.18,73.34 T85.1 | 315.91,60.64 315.91,72.07 | 315.91,72.07 315.91,82.87 | 315.91,82.87 T84.1 | 315.91,94.3 317.18,95.57 T83.1 | 315.91,82.87 315.91,94.3 | 315.91,94.3 315.91,105.09 T82.1 | T41.1 240.35,68.9 240.35,48.58 T53.1 230.82,39.05 | 225.74,46.67 225.74,44.13 | 225.74,44.13 225.74,26.67 225.11,26.04 T64.1 | 225.74,46.67 225.11,47.31 T52.1 | 225.74,68.9 225.11,69.53 T40.1 | 225.74,46.67 225.74,68.9 | 225.74,68.9 225.74,91.12 225.11,91.76 T28.1 225.11,92.39 225.74,93.03 225.74,113.67 T16.1 | 225.74,44.13 230.82,39.05 | 230.82,39.05 239.71,28.57 239.71,25.4 T65.1 | 197.17,113.35 197.17,93.03 196.53,92.39 T26.1 | 197.17,113.35 196.53,113.98 T14.1 | 197.17,29.21 197.17,47.62 T50.1 | 197.17,29.21 197.17,26.67 196.53,26.04 T62.1 | 211.77,29.21 211.77,46.67 T51.1 211.77,48.58 211.77,67.63 | 211.77,29.21 211.77,26.04 T63.1 | 211.77,67.63 211.77,68.9 T39.1 211.77,70.8 211.77,91.12 T27.1 211.77,93.03 211.77,113.35 T15.1 211.14,114.62 211.14,117.79 208.6,117.79 206.69,115.89 206.69,113.35 197.17,113.35 | 211.77,29.21 197.17,29.21
  Top 0.762: 183.2,73.34 183.2,91.12 T25.1 183.2,93.03 183.2,113.35 T13.1 | 183.2,73.34 183.2,70.8 T37.1 | T11.1 154.62,113.35 154.62,93.03 T23.1 154.62,91.12 154.62,70.8 T35.1 168.59,54.93 | 168.59,46.67 168.59,26.67 167.96,26.04 T60.1 | 168.59,46.67 167.96,47.31 T48.1 | 168.59,68.9 167.96,69.53 T36.1 | 168.59,54.93 168.59,46.67 | 168.59,68.9 168.59,54.93 | 168.59,73.34 168.59,68.9 | 168.59,73.34 168.59,91.12 167.96,91.76 T24.1 | 183.2,73.34 168.59,73.34 | 211.77,67.63 196.53,67.63 T38.1 | T45.1 126.05,48.58 126.05,68.9 T33.1 126.05,70.8 126.05,91.12 T21.1 126.05,93.03 126.05,113.35 T9.1 126.05,115.25 | 126.05,115.25 136.53,122.56 | 111.44,29.21 111.44,46.67 110.81,47.31 T44.1 | 111.44,29.21 111.44,26.67 110.81,26.04 T56.1 | 140.02,46.67 139.38,47.31 T46.1 | 140.02,46.67 140.02,25.4 T58.1 | 140.02,68.9 139.38,69.53 T34.1 | 140.02,46.67 140.02,68.9 | 140.02,91.12 139.38,91.76 T22.1 | 140.02,68.9 140.02,91.12 | 140.02,91.12 140.02,101.28 | 140.02,101.28 140.02,113.35 139.38,113.98 T10.1 | 111.44,29.21 125.41,29.21 125.41,25.4 T57.1 | 140.02,101.28 126.05,115.25 | 50.8,122.56 T3.1 39.05,113.98 39.05,111.44 21.27,111.44 20,112.71 20,113.98 11.11,113.98 T1.1 | T71.1 67.31,25.4 67.31,23.5 65.41,23.5 63.5,25.4 T70.1 53.34,25.4 52.7,24.77 52.7,24.13 52.07,23.5 39.37,23.5 T69.1 38.73,25.4 36.83,23.5 25.4,23.5 25.4,25.4 T68.1 | T6.1 79.69,113.98 68.26,113.98 T5.1 | T43.1 97.47,48.58 97.47,68.9 T31.1 97.47,70.8 97.47,91.12 T19.1 97.47,93.03 97.47,113.35 T7.1 | T29.1 240.35,93.03 240.35,113.35 T17.1 | 315.91,35.56 283.21,35.56 GND.1
  Bottom 0.762: 344.49,93.03 344.49,94.3 345.76,95.57 T77.1 | 344.49,93.03 344.49,88.58 | 344.49,88.58 344.49,86.04 T78.1 | 349.57,88.58 358.46,88.58 358.46,87.31 T75.1 | 344.49,88.58 349.57,88.58 | 344.49,93.03 317.82,93.03 317.82,95.57 T83.1 | 349.57,88.58 349.57,72.71 347.03,72.71 346.39,73.34 T79.1 | T65.1 239.71,25.4 239.71,23.5 251.14,23.5 253.05,25.4 T66.1 254.32,25.4 254.32,35.56 | T12.1 167.96,113.98 178.12,113.98 178.12,113.35 178.75,112.71 181.93,112.71 181.93,113.98 T13.1 | T38.1 196.53,69.53 195.26,68.26 182.56,68.26 182.56,69.53 T37.1 | 183.2,29.21 183.2,43.18 181.93,44.45 181.93,47.31 T49.1 | 183.2,29.21 183.2,26.04 T61.1 | 154.62,46.04 154.62,46.67 T47.1 | 154.62,46.04 154.62,29.21 | 154.62,29.21 154.62,26.04 T59.1 | 154.62,46.04 167.96,46.04 T48.1 | 183.2,29.21 168.59,29.21 168.59,25.4 T60.1 | T57.1 134.94,25.4 136.84,23.5 138.75,23.5 138.75,25.4 T58.1 140.02,25.4 140.02,29.21 154.62,29.21 | T1.1 11.11,114.62 20.64,114.62 20.64,115.89 22.54,117.79 25.72,117.79 25.72,115.25 25.08,114.62 T2.1 | T67.1 20.95,25.4 20.95,24.13 21.59,23.5 24.77,23.5 24.77,25.4 T68.1 25.4,25.4 40.32,43.5 40.32,113.35 T3.1 | T4.1 53.66,113.98 63.82,113.98 63.82,113.35 64.45,112.71 67.63,112.71 67.63,113.98 T5.1 | 99.06,31.11 97.47,46.67 T43.1 | 99.06,31.11 97.47,26.04 T55.1 | 99.06,31.11 82.87,46.67 | 82.87,46.67 82.23,47.31 T72.1 | T31.1 96.84,69.53 96.84,68.26 109.54,68.26 110.81,69.53 T32.1 110.81,70.17 111.44,70.8 | 111.44,91.12 110.81,91.76 T20.1 | 111.44,70.8 111.44,91.12 | 111.44,91.12 111.44,113.35 110.81,113.98 T8.1 | T6.1 79.69,114.62 80.96,115.89 92.39,115.89 92.39,113.35 93.03,112.71 96.2,112.71 96.2,113.98 T7.1
  Bottom 0.762: 82.87,46.67 79.06,42.86 79.06,40.32 67.94,26.04 T71.1 | 111.44,70.8 111.44,48.58 110.81,47.94 T44.1 | T52.1 225.11,47.31 223.84,46.04 211.14,46.04 211.14,47.31 T51.1 | 254.32,91.12 254.32,70.8 253.68,70.17 T42.1 253.68,69.53 254.32,68.9 254.32,45.4 | 254.32,91.12 253.68,91.76 T30.1 | 254.32,91.12 254.32,113.35 253.68,113.98 T18.1 | 254.32,35.56 254.32,45.4 | 254.32,45.4 T54.1 | 254.32,35.56 281.94,35.56 GND.1 | T17.1 237.81,112.71 225.11,112.71 T16.1
IF0
  Top 0.381: T4.2 52.39,116.52 52.7,117.79 52.7,128.91 C40BOT.14
IF1
  Bottom 0.381: T5.2 55.24,127.64 52.7,127.64 52.7,128.91 C40TOP.14
IF2
  Top 0.381: T6.2 80.96,115.25 67.31,128.91 60.33,128.91 C40BOT.19
ION
  Top 0.381: T73.2 354.96,109.86 354.96,120.02 346.07,128.91 D40BOT.19
IOT
  Top 0.406: D40BOT.9 330.2,128.59 328.61,127 328.61,50.48 T88.2
ISZ
  Top 0.381: T84.2 322.26,88.58 322.26,126.68 320.68,128.27 D40BOT.3
JMP
  Top 0.381: T87.2 319.72,52.39 327.34,60.01 327.34,126.68 325.75,128.27 325.75,128.91 D40BOT.6
JMS
  Top 0.381: T86.2 324.8,68.9 324.8,127.32 323.85,128.27 D40BOT.5
LINK
  Top 0.381: T72.2 80.96,49.85 56.52,74.3 56.52,127.64 55.88,128.27 55.88,128.91 C40BOT.16
MA0
  Bottom 0.381: T19.2 103.82,102.55 103.82,116.52 118.75,128.27 118.75,128.91 E40TOP.2
MA1
  Top 0.381: T20.2 109.54,93.66 107,93.66 107,61.91 108.9,60.01 113.35,60.01 113.35,100.01 107,106.36 107,116.52 121.92,128.27 121.92,128.91 E40BOT.4
MA2
  Bottom 0.381: T21.2 126.68,96.84 126.68,127 127,128.27 E40TOP.7
MA3
  Top 0.381: T22.2 138.11,93.66 127.32,93.66 127.32,47.31 126.05,46.04 119.38,46.04 119.38,116.2 134.62,128.27 134.62,128.91 E40BOT.12
MA4
  Bottom 0.381: T23.2 141.92,104.46 141.92,124.46 139.7,128.27 E40TOP.15
MA5
  Top 0.381: T24.2 166.69,94.3 157.16,103.82 157.16,115.25 144.78,127.64 144.78,128.91 E40BOT.18
MA6
  Bottom 0.381: T25.2 191.45,104.46 191.45,118.43 204.47,128.27 204.47,128.91 F40TOP.2
MA7
  Top 0.381: T26.2 195.26,94.3 192.72,96.84 192.72,115.89 207.65,127.64 207.65,128.91 F40BOT.4
MA8
  Bottom 0.381: T27.2 212.41,96.84 212.41,127 212.72,128.27 F40TOP.7
MA9
  Top 0.381: T28.2 223.84,94.3 219.39,98.74 219.71,127 220.98,128.27 220.98,128.91 F40BOT.12
MA10
  Bottom 0.381: T29.2 240.98,96.84 240.98,115.89 233.04,123.83 225.43,123.83 F40TOP.15
MA11
  Top 0.381: T30.2 252.41,94.3 245.43,101.28 245.43,113.98 231.78,127.64 230.5,127.64 230.5,128.91 F40BOT.18
MB0
  Bottom 0.381: T31.2 93.66,73.34 93.66,87.95 96.2,90.49 105.09,90.49 105.09,115.89 120.65,128.27 E40TOP.3
MB1
  Top 0.381: T32.2 109.54,72.07 112.08,74.61 112.08,100.01 105.73,106.36 105.73,116.52 120.65,128.27 E40BOT.3
MB2
  Bottom 0.381: T33.2 127.95,75.88 127.95,127.64 128.91,128.27 128.91,128.91 E40TOP.8
MB3
  Top 0.381: T34.2 138.11,71.44 128.59,71.44 128.59,47.31 126.05,44.77 118.43,44.77 118.43,116.52 133.35,128.27 E40BOT.11
MB4
  Bottom 0.381: T35.2 155.26,74.61 155.26,100.65 144.46,111.44 144.46,124.78 141.6,127.64 141.6,128.91 E40TOP.16
MB5
  Top 0.381: T36.2 166.69,72.07 155.89,82.87 155.89,115.25 142.88,128.27 E40BOT.17
MB6
  Bottom 0.381: T37.2 192.72,83.5 192.72,117.79 206.38,128.27 F40TOP.3
MB7
  Top 0.381: T38.2 195.26,66.99 197.17,65.09 197.17,61.28 195.9,60.01 190.82,60.01 190.82,115.89 206.38,128.27 F40BOT.3
MB8
  Bottom 0.381: T39.2 213.68,75.88 213.68,127.64 214.63,128.27 214.63,128.91 F40TOP.8
MB9
  Top 0.381: T40.2 223.84,72.07 217.49,78.42 217.49,127 219.07,128.59 F40BOT.11
MB10
  Bottom 0.381: T41.2 242.25,75.88 242.25,115.89 233.04,125.09 227.33,125.09 227.33,128.91 F40TOP.16
MB11
  Top 0.381: T42.2 252.41,72.07 244.16,80.33 244.16,113.98 231.78,126.36 230.5,126.36 229.24,127.64 229.24,128.27 228.6,128.91 F40BOT.17
MQ0
  Bottom 0.381: T55.2 92.39,27.3 92.39,24.77 93.03,24.13 107,24.13 107,42.23 109.54,44.77 119.7,44.77 119.7,120.97 123.83,125.09 E40TOP.5
MQ1
  Top 0.381: T56.2 109.54,27.94 102.55,36.51 102.55,121.92 109.54,128.91 117.47,128.91 E40BOT.1
MQ2
  Bottom 0.381: T57.2 124.14,27.3 133.67,38.42 133.67,125.41 136.53,128.27 E40TOP.13
MQ3
  Top 0.381: T58.2 126.68,27.3 128.27,29.84 121.6,36.51 115.89,36.51 115.89,120.02 125.09,127.64 125.09,128.91 E40BOT.6
MQ4
  Bottom 0.381: T59.2 149.54,27.3 149.54,24.77 150.18,24.13 164.15,24.13 164.15,34.61 169.23,39.69 169.23,56.83 159.7,66.36 159.7,113.35 144.78,128.27 144.78,128.91 E40TOP.18
MQ5
  Top 0.381: T60.2 166.69,22.86 168.59,20.95 168.59,16.51 167.96,15.88 141.29,15.88 141.29,118.43 139.7,120.02 E40BOT.15
MQ6
  Bottom 0.381: T61.2 178.12,27.3 178.12,24.77 178.75,24.13 192.72,24.13 192.72,34.61 206.69,48.58 206.69,123.83 209.55,126.68 F40TOP.5
MQ7
  Top 0.381: T62.2 195.26,22.86 197.17,20.95 197.17,16.51 196.53,15.88 178.12,15.88 178.12,56.2 188.28,66.36 188.28,122.87 194.31,128.91 203.2,128.91 F40BOT.1
MQ8
  Bottom 0.381: T63.2 206.69,27.3 206.69,24.77 207.33,24.13 219.39,24.13 219.39,40.32 223.84,44.77 226.38,44.77 226.38,55.56 218.76,63.18 218.76,124.78 222.25,128.27 F40TOP.13
MQ9
  Top 0.381: T64.2 223.84,27.94 213.04,40.32 213.04,126.68 211.46,128.27 211.46,128.91 F40BOT.6
MQ10
  Bottom 0.381: T65.2 238.44,27.3 244.79,35.24 244.79,115.89 233.04,127.64 230.5,127.64 230.5,128.91 F40TOP.18
MQ11
  Top 0.381: T66.2 252.41,27.94 241.62,40.32 241.62,77.79 228.28,91.12 228.28,125.41 225.43,128.27 F40BOT.15
N$1
  Top 0.381: T1.3 9.21,113.35 9.21,109.54 DF0.B
N$2
  Bottom 0.381: T2.3 22.54,113.98 23.18,113.35 23.18,109.54 DF1.B
N$3
  Bottom 0.381: T3.3 37.78,113.35 37.78,109.54 DF2.B
N$4
  Top 0.381: T4.3 51.12,113.98 51.75,113.35 51.75,109.54 IF0.B
N$5
  Top 0.381: T5.3 66.36,113.35 66.36,109.54 IF1.B
N$6
  Top 0.381: T6.3 82.23,110.17 IF2.B
N$7
  Top 0.381: T7.3 94.93,113.35 94.93,109.54 PC0.B
N$8
  Top 0.381: T8.3 108.27,113.98 108.9,113.35 108.9,109.54 PC1.B
N$9
  Top 0.381: T9.3 123.51,113.35 123.51,109.54 PC2.B
N$10
  Top 0.381: T10.3 136.84,113.98 137.48,113.35 137.48,109.54 PC3.B
N$11
  Top 0.381: T11.3 152.08,113.35 152.08,109.54 PC4.B
N$12
  Top 0.381: T12.3 165.42,113.98 166.05,113.35 166.05,109.54 PC5.B
N$13
  Top 0.381: T13.3 180.66,113.35 180.66,109.54 PC6.B
N$14
  Top 0.381: T14.3 193.99,113.98 194.63,113.35 194.63,109.54 PC7.B
N$15
  Top 0.381: T15.3 209.23,113.35 209.23,109.54 PC8.B
N$16
  Top 0.381: T16.3 222.57,110.17 PC9.B
N$17
  Top 0.381: T17.3 237.81,113.35 237.81,109.54 PC10.B
N$18
  Top 0.381: T18.3 251.14,113.98 251.78,113.35 251.78,109.54 PC11.B
N$19
  Top 0.381: T19.3 94.93,91.12 94.93,87.31 MA0.B
N$20
  Top 0.381: T20.3 108.27,91.76 108.9,91.12 108.9,87.31 MA1.B
N$21
  Top 0.381: T21.3 123.51,91.12 123.51,87.31 MA2.B
N$22
  Top 0.381: T22.3 136.84,91.76 137.48,91.12 137.48,87.31 MA3.B
N$23
  Top 0.381: T23.3 152.08,91.12 152.08,87.31 MA4.B
N$24
  Top 0.381: T24.3 165.42,91.76 166.05,91.12 166.05,87.31 MA5.B
N$25
  Top 0.381: T25.3 180.66,91.12 180.66,87.31 MA6.B
N$26
  Top 0.381: T26.3 193.99,91.76 194.63,91.12 194.63,87.31 MA7.B
N$27
  Top 0.381: T27.3 209.23,91.12 209.23,87.31 MA8.B
N$28
  Top 0.381: T28.3 222.57,91.76 223.2,91.12 223.2,87.31 MA9.B
N$29
  Top 0.381: T29.3 237.81,91.12 237.81,87.31 MA10.B
N$30
  Top 0.381: T30.3 251.14,91.76 251.78,91.12 251.78,87.31 MA11.B
N$31
  Top 0.381: T31.3 94.93,68.9 94.93,65.09 MB0.B
N$32
  Top 0.381: T32.3 108.27,69.53 108.9,68.9 108.9,65.09 MB1.B
N$33
  Top 0.381: T33.3 123.51,68.9 123.51,65.09 MB2.B
N$34
  Top 0.381: T34.3 136.84,69.53 137.48,68.9 137.48,65.09 MB3.B
N$35
  Top 0.381: T35.3 152.08,68.9 152.08,65.09 MB4.B
N$36
  Top 0.381: T36.3 165.42,69.53 166.05,68.9 166.05,65.09 MB5.B
N$37
  Top 0.381: T37.3 180.66,68.9 180.66,65.09 MB6.B
N$38
  Top 0.381: T38.3 193.99,65.72 MB7.B
N$39
  Bottom 0.381: T39.3 209.23,68.9 209.23,65.09 MB8.B
N$40
  Top 0.381: T40.3 222.57,69.53 223.2,68.9 223.2,65.09 MB9.B
N$41
  Top 0.381: T41.3 237.81,68.9 237.81,65.09 MB10.B
N$42
  Top 0.381: T42.3 251.14,69.53 251.78,68.9 251.78,65.09 MB11.B
N$43
  Top 0.381: T43.3 94.93,46.67 94.93,42.86 AC0.B
N$44
  Top 0.381: T44.3 108.27,47.31 108.9,46.67 108.9,42.86 AC1.B
N$45
  Bottom 0.381: T45.3 123.51,46.67 123.51,42.86 AC2.B
N$46
  Top 0.381: T46.3 136.84,47.31 137.48,46.67 137.48,42.86 AC3.B
N$47
  Top 0.381: T47.3 152.08,46.67 152.08,42.86 AC4.B
N$48
  Top 0.381: T48.3 165.42,47.31 166.05,46.67 166.05,42.86 AC5.B
N$49
  Top 0.381: T49.3 180.66,46.67 180.66,42.86 AC6.B
N$50
  Top 0.381: T50.3 195.26,46.67 195.26,42.86 AC7.B
N$51
  Top 0.381: T51.3 209.23,46.67 209.23,42.86 AC8.B
N$52
  Top 0.381: T52.3 222.57,47.31 223.2,46.67 223.2,42.86 AC9.B
N$53
  Bottom 0.381: T53.3 237.81,46.67 237.81,42.86 AC10.B
N$54
  Top 0.381: T54.3 251.78,45.4 251.78,42.86 AC11.B
N$55
  Top 0.381: T55.3 94.3,25.4 94.93,24.77 94.93,20.32 MQ0.B
N$56
  Top 0.381: T56.3 108.27,24.77 108.9,24.13 108.9,20.32 MQ1.B
N$57
  Top 0.381: T57.3 122.87,25.4 123.51,24.77 123.51,20.32 MQ2.B
N$58
  Top 0.381: T58.3 136.84,24.77 137.48,24.13 137.48,20.32 MQ3.B
N$59
  Top 0.381: T59.3 151.45,25.4 152.08,24.77 152.08,20.32 MQ4.B
N$60
  Bottom 0.381: T60.3 165.42,24.77 166.05,24.13 166.05,20.32 MQ5.B
N$61
  Top 0.381: T61.3 180.02,25.4 180.66,24.77 180.66,20.32 MQ6.B
N$62
  Bottom 0.381: T62.3 193.99,24.77 194.63,24.13 194.63,20.32 MQ7.B
N$63
  Top 0.381: T63.3 208.6,25.4 209.23,24.77 209.23,20.32 MQ8.B
N$64
  Top 0.381: T64.3 222.57,24.77 223.2,24.13 223.2,20.32 MQ9.B
N$65
  Top 0.381: T65.3 237.17,25.4 237.81,24.77 237.81,20.32 MQ10.B
N$66
  Top 0.381: T66.3 251.14,24.77 251.78,24.13 251.78,20.32 MQ11.B
N$67
  Top 0.381: T67.3 8.26,24.77 8.89,24.13 8.89,20.32 SC0.B
N$68
  Top 0.381: T68.3 22.86,25.4 23.5,24.77 23.5,20.32 SC1.B
N$69
  Bottom 0.381: T69.3 36.83,24.77 37.47,24.13 37.47,20.32 SC2.B
N$70
  Bottom 0.381: T70.3 51.44,25.4 52.07,24.77 52.07,20.32 SC3.B
N$71
  Bottom 0.381: T71.3 65.41,24.77 66.04,24.13 66.04,20.32 SC4.B
N$72
  Top 0.381: T72.3 79.69,47.31 80.33,46.67 80.33,42.86 LINK.B
N$73
  Bottom 0.381: T73.3 359.09,107 364.81,107 ION.B
N$74
  Bottom 0.381: T74.3 364.81,95.57 364.81,96.2 366.08,97.47 PAUSE.B
N$75
  Top 0.381: T75.3 359.09,84.77 364.81,84.77 RUN.B
N$76
  Bottom 0.381: T76.3 345.76,108.9 FETCH.B
N$77
  Bottom 0.381: T77.3 338.77,98.11 EXECUTE.B
N$78
  Top 0.381: T78.3 345.76,86.68 DEFER.B
N$79
  Bottom 0.381: T79.3 338.77,75.88 WORDCOUNT.B
N$80
  Bottom 0.381: T80.3 345.76,64.45 CURRENTADDRESS.B
N$81
  Bottom 0.381: T81.3 338.77,53.66 BREAK.B
N$82
  Top 0.381: T82.3 317.18,108.9 AND.B
N$83
  Bottom 0.381: T83.3 310.2,98.11 TAD.B
N$84
  Bottom 0.381: T84.3 317.18,86.68 ISZ.B
N$85
  Bottom 0.381: T85.3 310.2,75.88 DCA.B
N$86
  Bottom 0.381: T86.3 317.18,64.45 JMS.B
N$87
  Bottom 0.381: T87.3 310.2,53.66 JMP.B
N$88
  Bottom 0.381: T88.3 317.18,42.23 IOT.B
N$89
  Bottom 0.381: T89.3 310.2,31.43 OPR.B
OPR
  Top 0.381: T89.2 319.72,30.16 331.15,41.59 331.15,126.68 333.38,128.91 D40BOT.11
PAUSE
  Bottom 0.381: T74.2 356.55,96.84 349.57,103.82 336.23,103.82 336.23,124.78 342.9,128.27 D40TOP.17
PC0
  Bottom 0.381: T7.2 111.12,128.91 117.47,128.91 E40TOP.1
PC1
  Top 0.381: T8.2 109.54,116.52 123.83,127.64 E40BOT.5
PC2
  Bottom 0.381: T9.2 125.09,118.11 125.09,128.91 E40TOP.6
PC3
  Top 0.381: T10.2 138.11,116.52 138.43,117.16 138.43,128.91 E40BOT.14
PC4
  Bottom 0.381: T11.2 152.72,115.89 154.62,115.89 156.53,113.98 156.53,70.17 154.62,68.26 142.56,68.26 142.56,102.55 140.65,104.46 140.65,124.46 138.43,128.27 138.43,128.91 E40TOP.14
PC5
  Top 0.381: T12.2 166.69,116.52 158.43,116.52 146.05,128.91 E40BOT.19
PC6
  Bottom 0.381: T13.2 196.85,128.91 203.2,128.91 F40TOP.1
PC7
  Top 0.381: T14.2 195.26,116.52 209.55,127.64 F40BOT.5
PC8
  Bottom 0.381: T15.2 210.82,118.11 210.82,128.91 F40TOP.6
PC9
  Top 0.381: 224.16,116.84 224.16,128.91 F40BOT.14
  Top 0.406: 224.16,116.84 224.16,116.52 T16.2
PC10
  Bottom 0.381: F40TOP.14 224.16,128.91 224.16,118.11 225.11,117.16 225.11,116.52 237.81,116.52 T17.2
PC11
  Top 0.381: F40BOT.19 231.78,128.91 244.16,116.52 252.41,116.52 T18.2
RUN
  Bottom 0.381: T75.2 357.19,85.41 357.19,83.5 358.46,82.23 368.62,82.23 368.62,109.54 350.52,127.64 344.81,127.64 344.81,128.91 D40TOP.18
SC0
  Bottom 0.381: T67.2 9.53,27.94 35.24,56.83 35.24,125.41 38.1,127.64 C40TOP.5
SC1
  Top 0.381: T68.2 23.5,27.3 5.4,45.4 5.4,120.02 5.4,121.6 12.7,128.91 14.29,128.91 31.75,128.91 C40BOT.1
SC2
  Bottom 0.381: T69.2 38.1,27.94 49.21,42.23 49.21,127 50.8,128.59 C40TOP.13
SC3
  Top 0.381: T70.2 52.07,27.3 6.67,72.71 6.67,115.89 8.57,117.79 21.27,117.79 21.27,113.35 21.91,112.71 35.24,112.71 35.24,123.51 39.37,126.05 39.37,128.91 C40BOT.6
SC4
  Bottom 0.381: T71.2 66.67,27.94 69.53,33.97 69.53,117.79 59.05,128.27 59.05,128.91 C40TOP.18
TAD
  Top 0.381: T83.2 319.72,96.84 320.99,98.11 320.99,126.68 319.4,128.27 319.4,128.91 D40BOT.2
WC
  Top 0.381: T79.2 348.3,74.61 352.43,78.74 352.43,118.75 342.9,128.27 D40BOT.17

### Text on the board
Bottom: PDP-8/I Light Board 50045108 | 5404519
tPlace: Transistor and trace placement differs from DEC's.